# Altium schematic sheet PHY.SchDoc
size A3
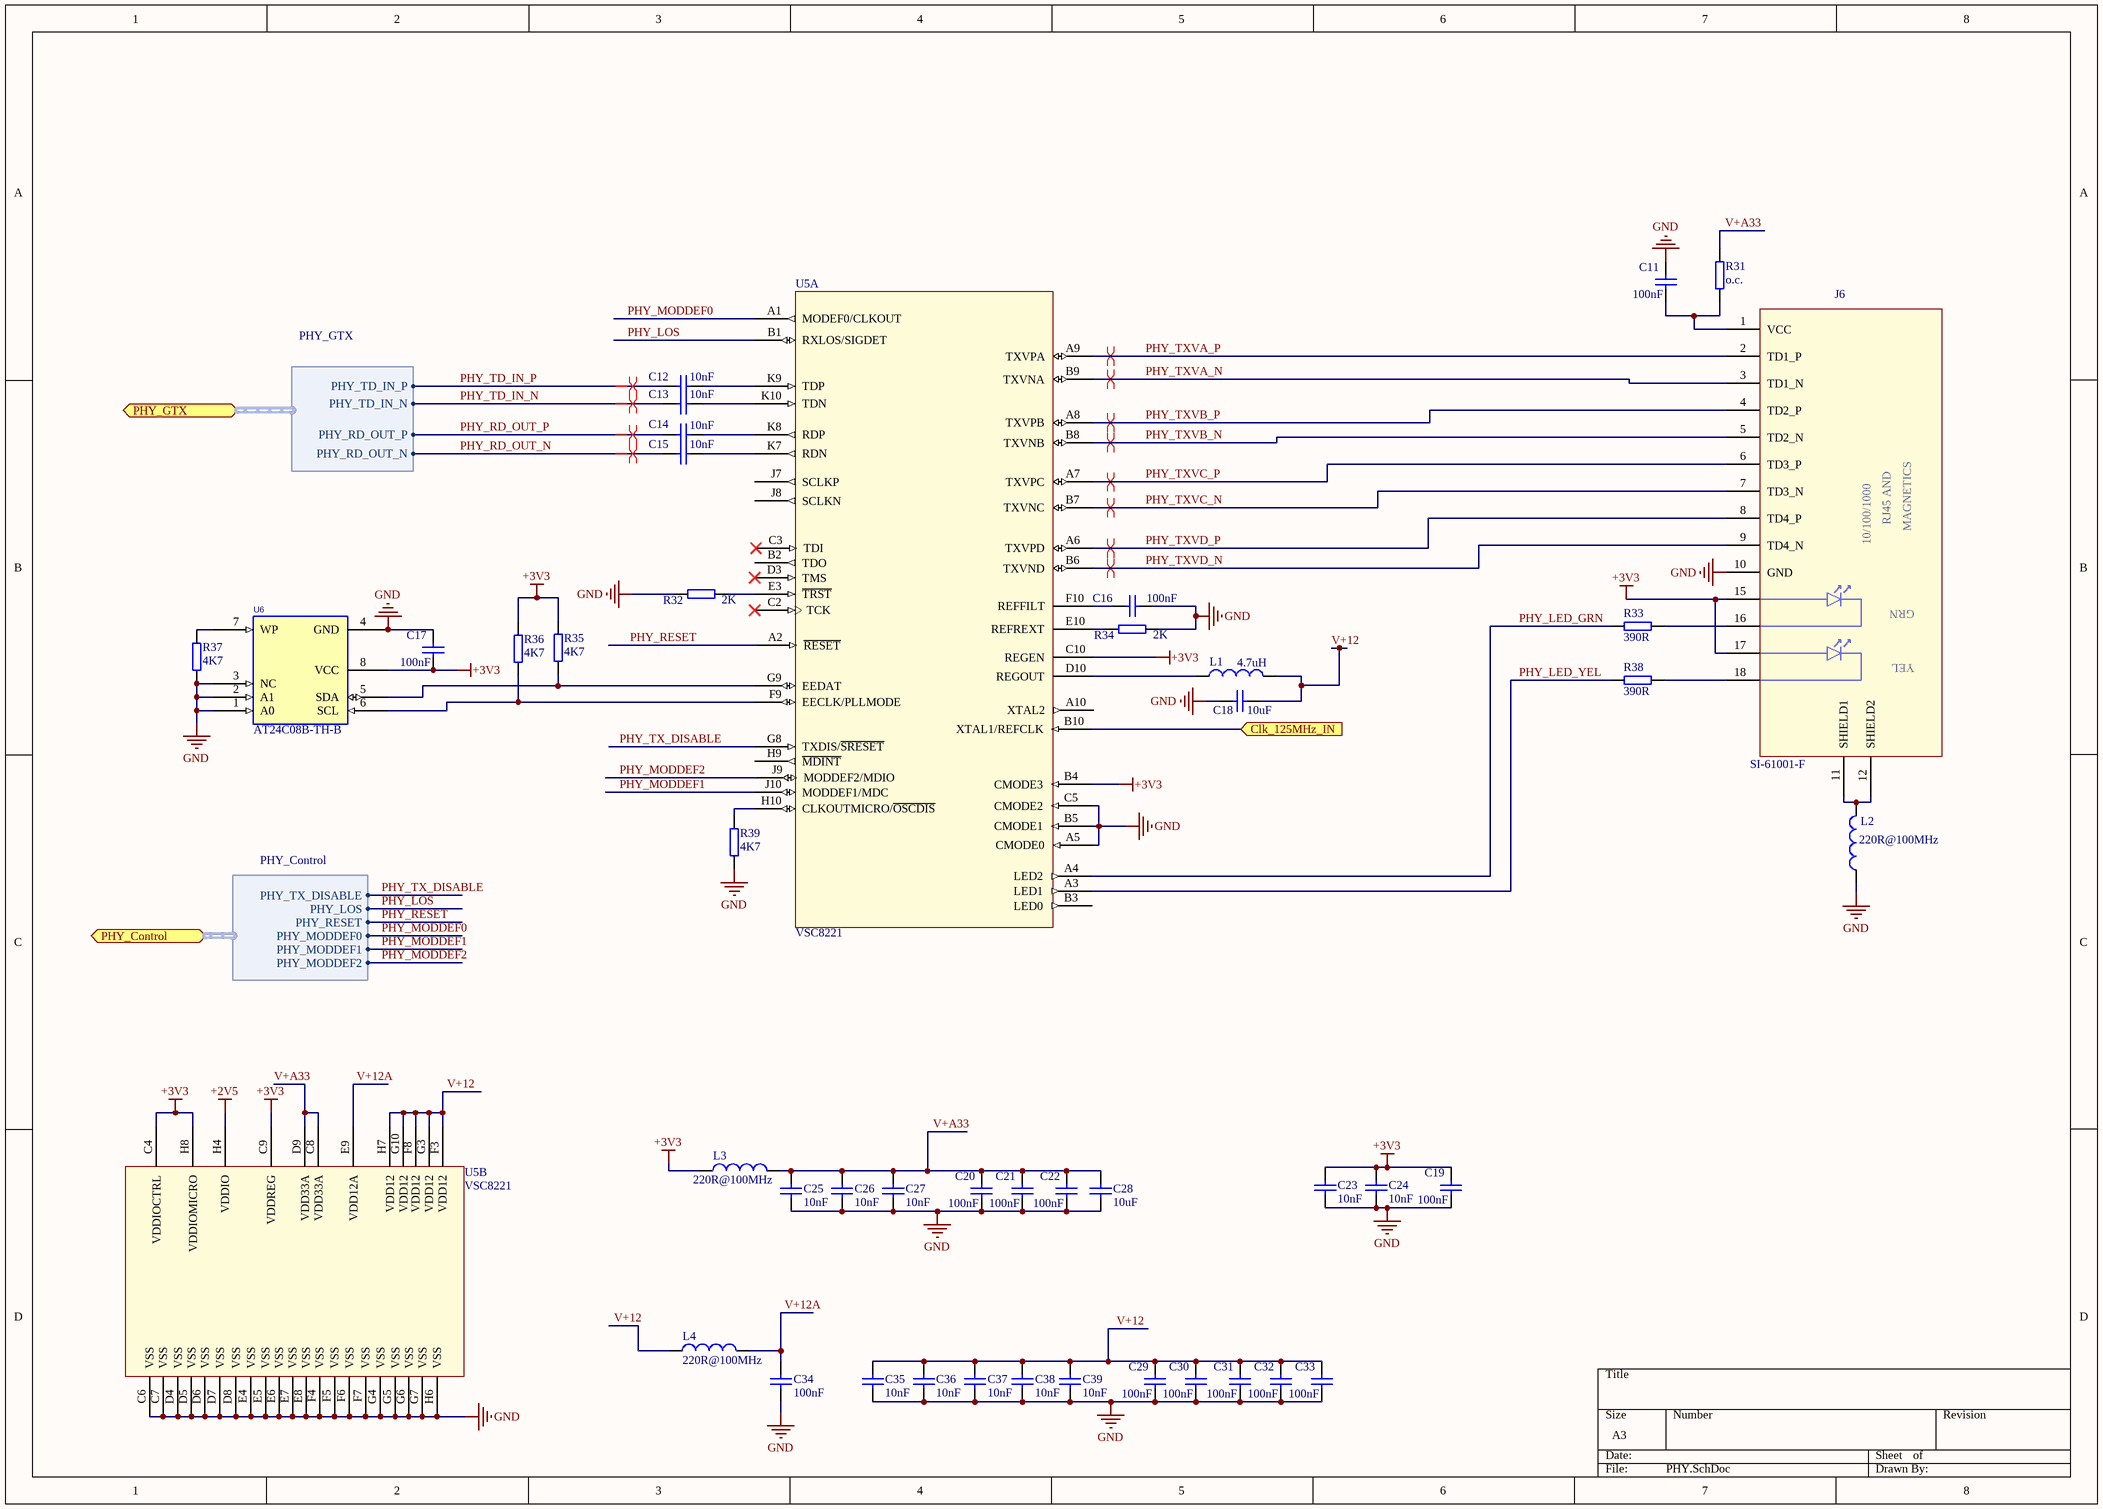
[diagram p0: PHY.SchDoc]

## Parts
C11  100nF  [CC1608-0603]
C12  10nF  [CC1608-0603]
C13  10nF  [CC1608-0603]
C14  10nF  [CC1608-0603]
C15  10nF  [CC1608-0603]
C16  100nF  [CC1608-0603]
C17  100nF  [CC1608-0603]
C18  10uF  [CC1608-0603]
C19  100nF  [CC1608-0603]
C20  100nF  [CC1608-0603]
C21  100nF  [CC1608-0603]
C22  100nF  [CC1608-0603]
C23  10nF  [CC1608-0603]
C24  10nF  [CC1608-0603]
C25  10nF  [CC1608-0603]
C26  10nF  [CC1608-0603]
C27  10nF  [CC1608-0603]
C28  10uF  [CC1608-0603]
C29  100nF  [CC1608-0603]
C30  100nF  [CC1608-0603]
C31  100nF  [CC1608-0603]
C32  100nF  [CC1608-0603]
C33  100nF  [CC1608-0603]
C34  100nF  [CC1608-0603]
C35  10nF  [CC1608-0603]
C36  10nF  [CC1608-0603]
C37  10nF  [CC1608-0603]
C38  10nF  [CC1608-0603]
C39  10nF  [CC1608-0603]
J6  SI-61001-F  [SI_61001_F]
L1  4.7uH  [INDC2016X160N]
L2  Impedance: 220R@100MHz  [0603]  (hidden comment: 220R@100MHz Ferrite Bead)
L3  Impedance: 220R@100MHz  [0603]  (hidden comment: 220R@100MHz Ferrite Bead)
L4  Impedance: 220R@100MHz  [0603]  (hidden comment: 220R@100MHz Ferrite Bead)
R31  o.c.  [0603]
R32  2K  [0603]
R33  390R  [0603]
R34  2K  [0603]
R35  4K7  [0603]
R36  4K7  [0603]
R37  4K7  [0603]
R38  390R  [0603]
R39  4K7  [0603]
U5  VSC8221  [BGA100C80P10X10_900X900X110]  (parts A,B of 2)
U6  AT24C08B-TH-B  [SOP65P640X120-8N]

## Ports
Clk_125MHz_IN (in), PHY_Control (harness PHY_Control), PHY_GTX (harness PHY_GTX)

## Harnesses
PHY_GTX: PHY_TD_IN_N, PHY_TD_IN_P, PHY_RD_OUT_N, PHY_RD_OUT_P
PHY_Control: PHY_RESET, PHY_LOS, PHY_MODDEF0, PHY_MODDEF1, PHY_MODDEF2, PHY_TX_DISABLE

## Nets
+2V5: U5.H4(VDDIO)
+3V3: C17.1 C19.2 C23.1 C24.1 J6.15(LED_GRN_A) J6.17(LED_YEL_A) L3.1 R35.1 R36.1 U5.B4(CMODE3) U5.C4(VDDIOCTRL) U5.C9(VDDREG) U5.C10(REGEN) U5.H8(VDDIOMICRO) U6.8(VCC)
GND: C11.2 C16.2 C17.2 C18.1 C19.1 C20.1 C21.1 C22.1 C23.2 C24.2 C25.2 C26.2 C27.2 C28.1 C29.1 C30.1 C31.1 C32.1 C33.1 C34.2 C35.2 C36.2 C37.2 C38.2 C39.2 J6.10(GND) L2.1 R32.1 R34.2 R37.1 R39.2 U5.A5(CMODE0) U5.B5(CMODE1) U5.C5(CMODE2) U5.C6(VSS) U5.C7(VSS) U5.D4(VSS) U5.D5(VSS) U5.D6(VSS) U5.D7(VSS) U5.D8(VSS) U5.E4(VSS) U5.E5(VSS) U5.E6(VSS) U5.E7(VSS) U5.E8(VSS) U5.F4(VSS) U5.F5(VSS) U5.F6(VSS) U5.F7(VSS) U5.G4(VSS) U5.G5(VSS) U5.G6(VSS) U5.G7(VSS) U5.H6(VSS) U6.1(A0) U6.2(A1) U6.3(NC) U6.4(GND)
Clk_125MHz_IN: U5.B10(XTAL1/REFCLK) ; port Clk_125MHz_IN
PHY_LED_GRN: R33.2 U5.A4(LED2)
PHY_LED_YEL: R38.2 U5.A3(LED1)
PHY_LOS: U5.B1(RXLOS/SIGDET) ; port PHY_Control.PHY_LOS
PHY_MODDEF0: U5.A1(MODEF0/CLKOUT) ; port PHY_Control.PHY_MODDEF0
PHY_MODDEF1: U5.J10(MODDEF1/MDC) ; port PHY_Control.PHY_MODDEF1
PHY_MODDEF2: U5.J9(MODDEF2/MDIO) ; port PHY_Control.PHY_MODDEF2
PHY_RD_OUT_N: C15.1 ; port PHY_GTX.PHY_RD_OUT_N
PHY_RD_OUT_P: C14.1 ; port PHY_GTX.PHY_RD_OUT_P
PHY_RESET: U5.A2(~{RESET}) ; port PHY_Control.PHY_RESET
PHY_TD_IN_N: C13.1 ; port PHY_GTX.PHY_TD_IN_N
PHY_TD_IN_P: C12.1 ; port PHY_GTX.PHY_TD_IN_P
PHY_TX_DISABLE: U5.G8(TXDIS/~{SRESET}) ; port PHY_Control.PHY_TX_DISABLE
PHY_TXVA_N: J6.3(TD1_N) U5.B9(TXVNA)
PHY_TXVA_P: J6.2(TD1_P) U5.A9(TXVPA)
PHY_TXVB_N: J6.5(TD2_N) U5.B8(TXVNB)
PHY_TXVB_P: J6.4(TD2_P) U5.A8(TXVPB)
PHY_TXVC_N: J6.7(TD3_N) U5.B7(TXVNC)
PHY_TXVC_P: J6.6(TD3_P) U5.A7(TXVPC)
PHY_TXVD_N: J6.9(TD4_N) U5.B6(TXVND)
PHY_TXVD_P: J6.8(TD4_P) U5.A6(TXVPD)
V+12: C18.2 C29.2 C30.2 C31.2 C32.2 C33.2 C35.1 C36.1 C37.1 C38.1 C39.1 L1.2 L4.1 U5.F3(VDD12) U5.F8(VDD12) U5.G3(VDD12) U5.G10(VDD12) U5.H7(VDD12)
V+12A: C34.1 L4.2 U5.E9(VDD12A)
V+A33: C20.2 C21.2 C22.2 C25.1 C26.1 C27.1 C28.2 L3.2 R31.2 U5.C8(VDD33A) U5.D9(VDD33A)
NetC11_1: C11.1 J6.1(VCC) R31.1
NetC12_2: C12.2 U5.K9(TDP)
NetC13_2: C13.2 U5.K10(TDN)
NetC14_2: C14.2 U5.K8(RDP)
NetC15_2: C15.2 U5.K7(RDN)
NetC16_1: C16.1 U5.F10(REFFILT)
NetJ6_11: J6.11(SHIELD1) J6.12(SHIELD2) L2.2
NetJ6_16: J6.16(LED_GRN_C) R33.1
NetJ6_18: J6.18(LED_YEL_C) R38.1
NetL1_1: L1.1 U5.D10(REGOUT)
NetR32_2: R32.2 U5.E3(~{TRST})
NetR34_1: R34.1 U5.E10(REFREXT)
NetR35_2: R35.2 U5.G9(EEDAT) U6.5(SDA)
NetR36_2: R36.2 U5.F9(EECLK/PLLMODE) U6.6(SCL)
NetR37_2: R37.2 U6.7(WP)
NetR39_1: R39.1 U5.H10(CLKOUTMICRO/~{OSCDIS})

Not connected (* = marked no-connect by the designer): U5 A10(XTAL2) B2(TDO) B3(LED0) C2(TCK)* C3(TDI)* D3(TMS)* H9(~{MDINT}) J7(SCLKP) J8(SCLKN)

## Layout directives
differential pair: PHY_RD_OUT_N, PHY_RD_OUT_P, PHY_TD_IN_N, PHY_TD_IN_P, PHY_TXVA_N, PHY_TXVA_P, PHY_TXVB_N, PHY_TXVB_P, PHY_TXVC_N, PHY_TXVC_P, PHY_TXVD_N, PHY_TXVD_P

## Notes on the sheet
- (in symbol RJ45_CONN_W_LED) RJ45 AND; MAGNETICS; 10/100/1000; GRN; YEL

## Library data of the parts
C11 C16 C17 C19-C22 C29-C34 = CC0603_100NF_16V_10%_X7R: Capacitor; Manufacturer1: AVX; Manufacturer1 PN: 0603YC104KAT2A; TC: X7R; Tolerance: ±10%; Voltage: 16V; Published: 8-Jun-2000; LatestRevisionDate: 17-Jul-2002; LatestRevisionNote: Re-released for DXP Platform.; PackageReference: RAD-0.3; Publisher: Altium Limited; Distributor1: Digikey; Distributor1 PN: 478-1239-1-ND; Case: 0603; Value: 100nF
C12-C15 C23-C27 C35-C39 = CC0603_10NF_50V_10%_X7R: Capacitor; Manufacturer1: AVX; Manufacturer1 PN: 06035C103KAT2A; TC: X7R; Tolerance: ±10%; Voltage: 16V; Published: 8-Jun-2000; LatestRevisionDate: 17-Jul-2002; LatestRevisionNote: Re-released for DXP Platform.; PackageReference: RAD-0.3; Publisher: Altium Limited; Distributor1: Digikey; Distributor1 PN: 478-1227-1-ND; Case: 0603; Value: 10nF
C18 C28 = CC0603_10UF_6.3V_20%_X5R: Capacitor; Manufacturer1: TDK; Manufacturer1 PN: C1608X5R0J106M; TC: X5R; Tolerance: ±20%; Voltage: 6.3V; Published: 8-Jun-2000; LatestRevisionDate: 17-Jul-2002; LatestRevisionNote: Re-released for DXP Platform.; PackageReference: RAD-0.3; Publisher: Altium Limited; Distributor1: Digikey; Distributor1 PN: 445-4112-1-ND; Case: 0603; Value: 10uF
J6 = RJ45_CONN_W_LED: Ethernet Connector MAGJACK W/LED 10/100/1000BT; Manufacturer1: Stewart Connector; PKG_TYPE: RJ45_WLED; Manufacturer1 PN: SI-61001-F; Distributor1: Digikey; Distributor1 PN: 380-1142-ND
L1 = Inductor: Manufacturer1 PN: BRC2016T4R7M; Manufacturer1: Taiyo Yuden; Code_IEC: 2016; Published: 8-Jun-2000; LatestRevisionDate: 17-Jul-2002; LatestRevisionNote: Re-released for DXP Platform.; Publisher: Altium Limited; Value: 4.7uH; Code_JEITA: 0805; Distributor1: Digikey; Distributor1 PN: 587-2175-1-ND
L2-L4 = L_FERRITE_BEAD: ferrite bead; Manufacturer1: Murata; Manufacturer1 PN: BLM18KG221SN1D; Current Rating: 2.2A; DCR: 50mOhm; Case: 0603; Distributor1: Digikey; Distributor1 PN: 490-5255-1-ND
R31 = R0603_O.C.: SMD Resistor; Manufacturer1: NA; Case: 0603; Manufacturer1 PN: NA; Distributor1: NA; Distributor1 PN: NA; TCR: NA; Power Rating: NA; Tolerance: NA; Value: o.c.
R32 R34 = R0603_2K0_±1%_0.1W_100PPM: SMD Resistor; Manufacturer1: Panasonic; Manufacturer1 PN: ERJ-3EKF2001V; TCR: 100ppm; Power Rating: 0.1W; Tolerance: ±1%; Case: 0603; Distributor1: DigiKey; Distributor1 PN: P2.00KHCT-ND; Value: 2K
R33 R38 = R0603_390R_±1%_0.1W_100PPM: SMD Resistor; Manufacturer1: Panasonic; Manufacturer1 PN: ERJ-3EKF3900V; TCR: 100ppm; Power Rating: 0.1W; Tolerance: ±1%; Case: 0603; Distributor1: DigiKey; Distributor1 PN: P390HCT-ND; Value: 390R
R35-R37 R39 = R0603_4.7K_±1%_0.1W_100PPM: SMD Resistor; Manufacturer1: Panasonic; Manufacturer1 PN: ERJ-3EKF4701V; TCR: 100ppm; Power Rating: 0.1W; Tolerance: ±1%; Case: 0603; Distributor1: DigiKey; Distributor1 PN: P4.70KHCT-ND; Value: 4K7
U5 = VSC8221: Single-Port 10/100/1000Base-T PHY with 1.25 Gbps SerDes for SFPs/GBICs; Manufacturer1: Vitesse; Manufacturer1 PN: VSC8221XHH; Distributor1: Digikey; Distributor1 PN: 907-1024-ND
U6 = AT24C08B-TH-B: Two-Wire 8KB Serial EEPROM; Manufacturer1: Atmel; Manufacturer1 PN: AT24C08B-TH-B; Distributor1: Digikey; Distributor1 PN: AT24C08B-TH-B-ND